# EAGLE schematic VCO-v2 (EAGLE 6.6.0)

## Sheet 1 of 9: Power This part of the circuit handles the input +-12 V supply lines. It creates internal regulated voltage supplies for +5, +9, -5, and -9 V.
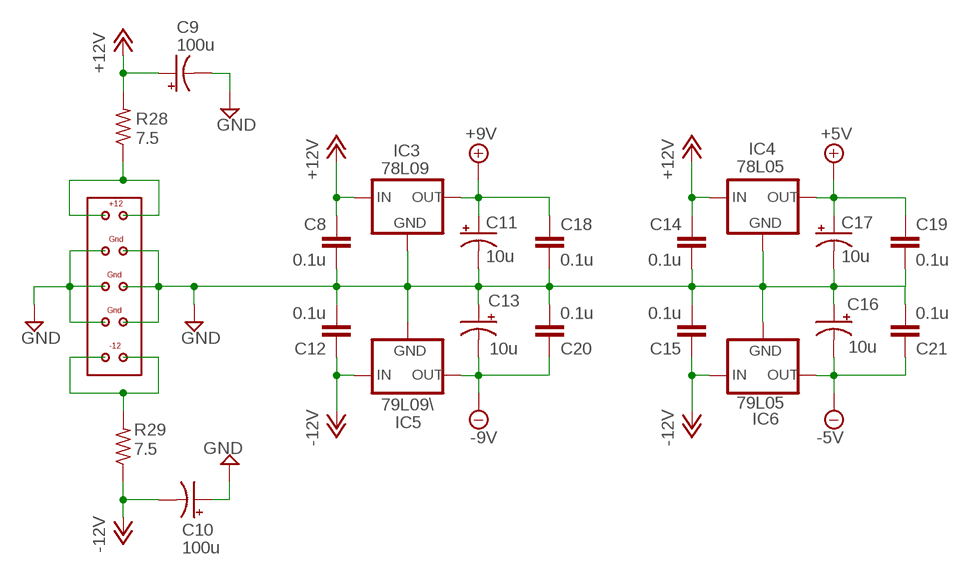
[diagram p0: schematic, sheet 1]

### Parts
C8  0.1u  C-EU025-050X050  [C025-050X050]
C9  100u  CPOL-USE3.5-10  [E3,5-10]
C10  100u  CPOL-USE3.5-10  [E3,5-10]
C11  10u  CPOL-USE3.5-10  [E3,5-10]
C12  0.1u  C-EU025-050X050  [C025-050X050]
C13  10u  CPOL-USE3.5-10  [E3,5-10]
C14  0.1u  C-EU025-050X050  [C025-050X050]
C15  0.1u  C-EU025-050X050  [C025-050X050]
C16  10u  CPOL-USE3.5-10  [E3,5-10]
C17  10u  CPOL-USE3.5-10  [E3,5-10]
C18  0.1u  C-EU025-050X050  [C025-050X050]
C19  0.1u  C-EU025-050X050  [C025-050X050]
C20  0.1u  C-EU025-050X050  [C025-050X050]
C21  0.1u  C-EU025-050X050  [C025-050X050]
IC3  78L09  78LXX  [78LXX]
IC4  78L05  78LXX  [78LXX]
IC5  79L09\  79LXX  [79LXX]
IC6  79L05  79LXX  [79LXX]
R28  7.5  R-US_0204/7  [0204/7]
R29  7.5  R-US_0204/7  [0204/7]
U$3  EURORACK-POWER  [EURORACK-POWER]

### Nets
+5V: C17.+ C19.1 IC4.OUT ; also sheet 2,3,7
+9V: C11.+ C18.1 IC3.OUT ; also sheet 4,8
+12V: C8.1 C9.+ C14.1 IC3.IN IC4.IN R28.2 ; also sheet 2,3,9
-5V: C16.- C21.1 IC6.OUT ; also sheet 2,3,4,5,7
-9V: C13.- C20.1 IC5.OUT ; also sheet 2,4,8
-12V: C10.- C12.1 C15.1 IC5.IN IC6.IN R29.1 ; also sheet 2,3,9
GND: C8.2 C9.- C10.+ C11.- C12.2 C13.+ C14.2 C15.2 C16.+ C17.- C18.2 C19.2 C20.2 C21.2 IC3.GND IC4.GND IC5.GND IC6.GND U$3.P$3 U$3.P$4 U$3.P$5 U$3.P$6 U$3.P$7 U$3.P$8 ; also sheet 2,3,5,6,7,8,9
N$34: R28.1 U$3.P$1 U$3.P$2
N$35: R29.2 U$3.P$9 U$3.P$10

## Sheet 2 of 9: Frequency CV This part of the circuit processes the control voltages for the frequency of the oscillator
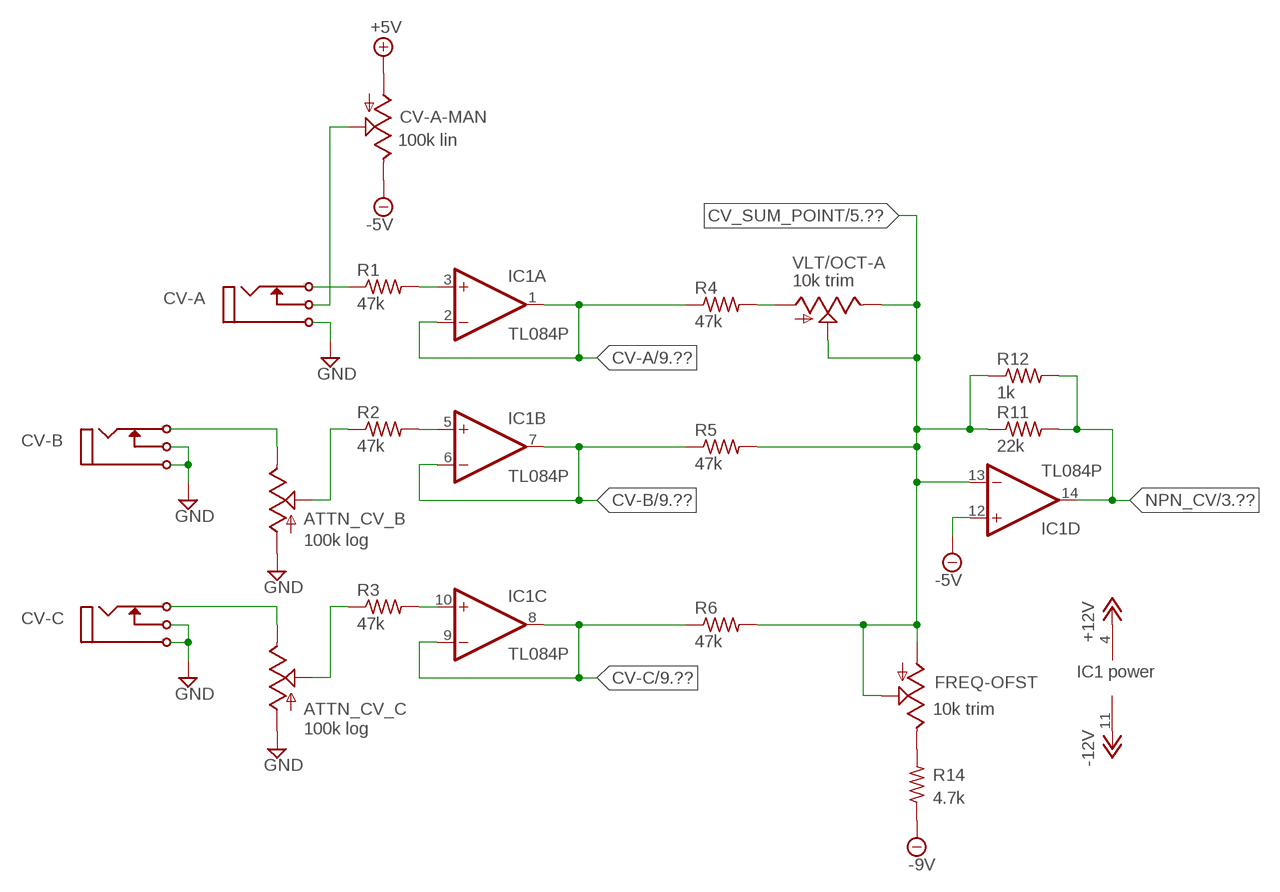
[diagram p1: schematic, sheet 2]

### Parts
ATTN_CV_B  100k log  TRIM_US-B64Y  [B64Y]
ATTN_CV_C  100k log  TRIM_US-B64Y  [B64Y]
CV-A  I/O  MONO_JACK  [MONO_JACK]
CV-A-MAN  100k lin  TRIM_US-B64Y  [B64Y]
CV-B  I/O  MONO_JACK  [MONO_JACK]
CV-C  I/O  MONO_JACK  [MONO_JACK]
FREQ-OFST  10k trim  TRIM_US-B64Y  [B64Y]
IC1  TL084P  [DIL14]
R1  47k  R-US_0204/7  [0204/7]
R2  47k  R-US_0204/7  [0204/7]
R3  47k  R-US_0204/7  [0204/7]
R4  47k  R-US_0204/7  [0204/7]
R5  47k  R-US_0204/7  [0204/7]
R6  47k  R-US_0204/7  [0204/7]
R11  22k  R-US_0204/7  [0204/7]
R12  1k  R-US_0204/7  [0204/7]
R14  4.7k  R-US_0204/7  [0204/7]
VLT/OCT-A  10k trim  TRIM_US-B64Y  [B64Y]

### Nets
+5V: CV-A-MAN.A ; also sheet 1,3,7
+12V: IC1.4(P:V+) ; also sheet 1,3,9
-5V: CV-A-MAN.E IC1.12(D:+IN) ; also sheet 1,3,4,5,7
-9V: R14.1 ; also sheet 1,4,8
-12V: IC1.11(P:V-) ; also sheet 1,3,9
CV-A: IC1.1(A:OUT) IC1.2(A:-IN) R4.1 ; also sheet 9
CV-B: IC1.6(B:-IN) IC1.7(B:OUT) R5.1 ; also sheet 9
CV-C: IC1.8(C:OUT) IC1.9(C:-IN) R6.1 ; also sheet 9
CV_SUM_POINT: FREQ-OFST.A IC1.13(D:-IN) R5.2 R6.2 R11.1 R12.1 VLT/OCT-A.E VLT/OCT-A.S ; also sheet 5
GND: ATTN_CV_B.A ATTN_CV_C.A CV-A.P$1 CV-B.P$1 CV-B.P$3(P3) CV-C.P$1 CV-C.P$3(P3) ; also sheet 1,3,5,6,7,8,9
N$1: CV-A-MAN.S CV-A.P$3(P3)
N$2: CV-A.P$2(P2) R1.1
N$3: IC1.3(A:+IN) IC1.5(B:+IN) IC1.10(C:+IN) R1.2 R2.2 R3.2
N$4: ATTN_CV_C.S R3.1
N$6: ATTN_CV_B.S R2.1
N$8: ATTN_CV_B.E CV-B.P$2(P2)
N$9: ATTN_CV_C.E CV-C.P$2(P2)
N$10: FREQ-OFST.S
N$13: R4.2 VLT/OCT-A.A
N$17: FREQ-OFST.E R14.2
NPN_CV: IC1.14(D:OUT) R11.2 R12.2 ; also sheet 3

### Notes on the sheet
- IC1 power

## Sheet 3 of 9: Voltage->Current This part of the circuit converts the linear voltage CV into a dual exponential current sink and source.
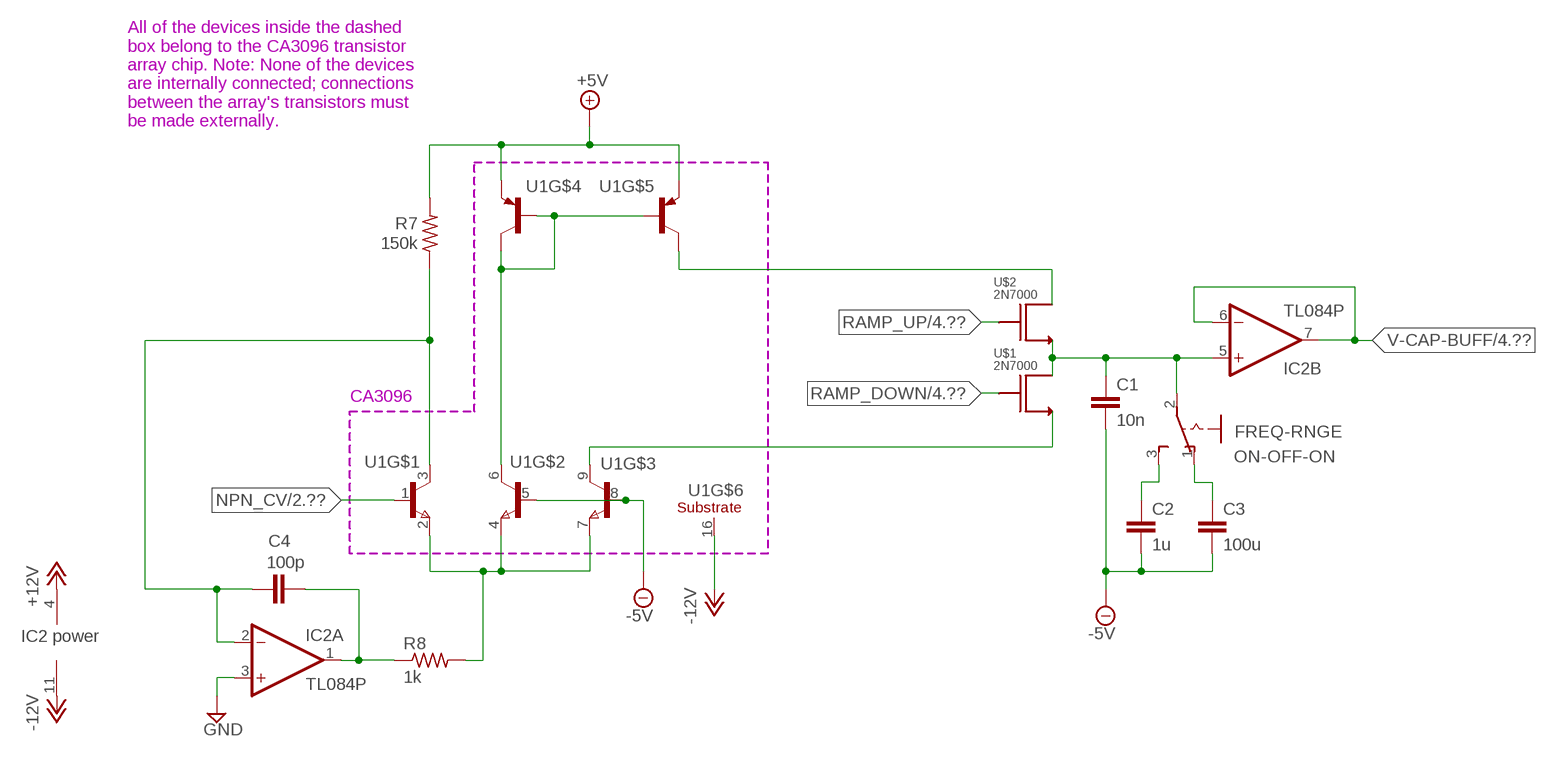
[diagram p2: schematic, sheet 3]

### Parts
C1  10n  C-EU025-025X050  [C025-025X050]
C2  1u  C-EU025-050X050  [C025-050X050]
C3  100u  C-EU050-075X075  [C050-075X075]
C4  100p  C-EU025-025X050  [C025-025X050]
FREQ-RNGE  255SB  [255SB]
IC2  TL084P  [DIL14]
R7  150k  R-US_0204/7  [0204/7]
R8  1k  R-US_0204/7  [0204/7]
U1  CA3096  [DIL16]
U$1  2N7000  [2N7000]
U$2  2N7000  [2N7000]

### Nets
+5V: R7.2 U1.10(E) U1.13(E) ; also sheet 1,2,7
+12V: IC2.4(P:V+) ; also sheet 1,2,9
-5V: C1.2 C2.2 C3.2 U1.5(B) U1.8(B) ; also sheet 1,2,4,5,7
-12V: IC2.11(P:V-) U1.16(E) ; also sheet 1,2,9
GND: IC2.3(A:+IN) ; also sheet 1,2,5,6,7,8,9
N$12: U1.6(C) U1.11(B) U1.12(C) U1.14(B)
N$14: C4.2 IC2.1(A:OUT) R8.1
N$15: R8.2 U1.2(E) U1.4(E) U1.7(E)
N$18: C2.1 FREQ-RNGE.3(S)
N$19: U1.9(C) U$1.S
N$20: U1.15(C) U$2.D
N$21: C4.1 IC2.2(A:-IN) R7.1 U1.3(C)
N$22: C3.1 FREQ-RNGE.1(O)
NPN_CV: U1.1(B) ; also sheet 2
RAMP_DOWN: U$1.G ; also sheet 4,5
RAMP_UP: U$2.G ; also sheet 4,5
TRIANGLE-RAW: C1.1 FREQ-RNGE.2(P) IC2.5(B:+IN) U$1.D U$2.S
V-CAP-BUFF: IC2.6(B:-IN) IC2.7(B:OUT) ; also sheet 4,6

### Notes on the sheet
- All of the devices inside the dashed
  box belong to the CA3096 transistor
  array chip. Note: None of the devices
  are internally connected; connections
  between the array's transistors must
  be made externally.
- CA3096
- ON-OFF-ON
- IC2 power

## Sheet 4 of 9: Hysteresis & Switching This part of the circuit detects when the voltage across the capacitors is too high/low and the caps need to be connected to the opposite polarity current sink/source.
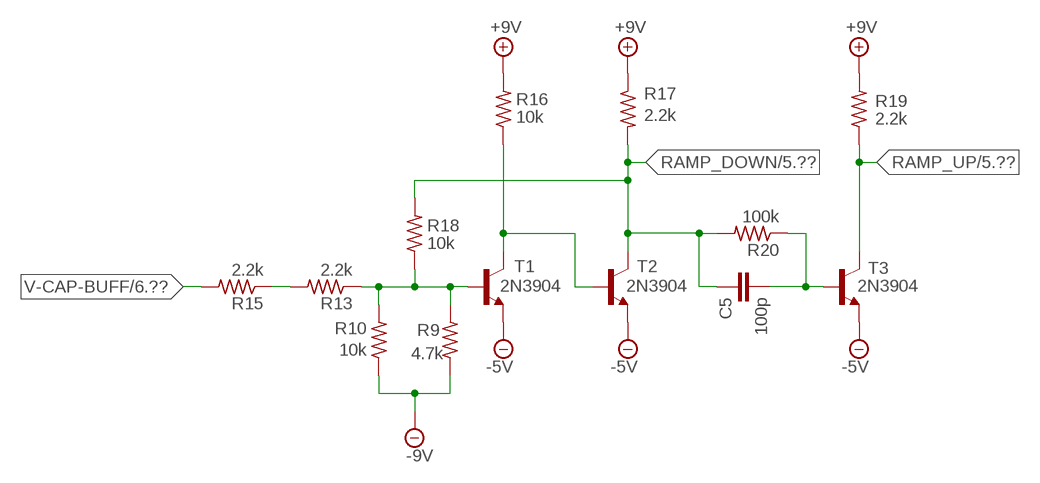
[diagram p3: schematic, sheet 4]

### Parts
C5  100p  C-EU025-050X050  [C025-050X050]
R9  4.7k  R-US_0204/7  [0204/7]
R10  10k  R-US_0204/7  [0204/7]
R13  2.2k  R-US_0204/7  [0204/7]
R15  2.2k  R-US_0204/7  [0204/7]
R16  10k  R-US_0204/7  [0204/7]
R17  2.2k  R-US_0204/7  [0204/7]
R18  10k  R-US_0204/7  [0204/7]
R19  2.2k  R-US_0204/7  [0204/7]
R20  100k  R-US_0204/7  [0204/7]
T1  2N3904  [TO92]
T2  2N3904  [TO92]
T3  2N3904  [TO92]

### Nets
+9V: R16.2 R17.1 R19.2 ; also sheet 1,8
-5V: T1.3(E) T2.3(E) T3.3(E) ; also sheet 1,2,3,5,7
-9V: R9.1 R10.1 ; also sheet 1,2,8
N$16: R16.1 T1.1(C) T2.2(B)
N$23: R9.2 R10.2 R13.1 R18.1 T1.2(B)
N$24: R13.2 R15.1
N$30: C5.2 R20.1 T3.2(B)
RAMP_DOWN: C5.1 R17.2 R18.2 R20.2 T2.1(C) ; also sheet 3,5
RAMP_UP: R19.1 T3.1(C) ; also sheet 3,5
V-CAP-BUFF: R15.2 ; also sheet 3,6

## Sheet 5 of 9: High Frequency Compensation This part of the circuit is responsible for compensating for the oscillator's switching time when transitioning between positive and negative slopes. transients are injected back into the CV_SUM_POINT to raise the effective CV slightly at high frequencies
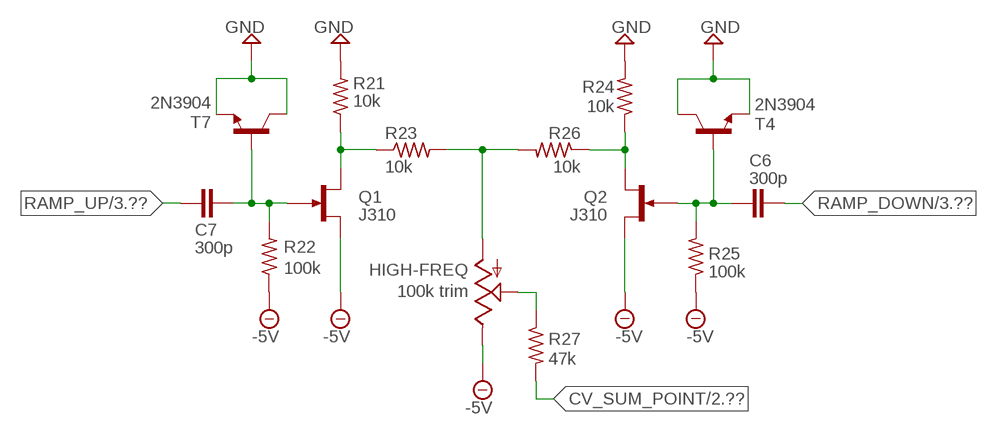
[diagram p4: schematic, sheet 5]

### Parts
C6  300p  C-EU025-050X050  [C025-050X050]
C7  300p  C-EU025-050X050  [C025-050X050]
HIGH-FREQ  100k trim  TRIM_US-B64Y  [B64Y]
Q1  J310  [TO92R]
Q2  J310  [TO92R]
R21  10k  R-US_0204/7  [0204/7]
R22  100k  R-US_0204/7  [0204/7]
R23  10k  R-US_0204/7  [0204/7]
R24  10k  R-US_0204/7  [0204/7]
R25  100k  R-US_0204/7  [0204/7]
R26  10k  R-US_0204/7  [0204/7]
R27  47k  R-US_0204/7  [0204/7]
T4  2N3904  [TO92]
T7  2N3904  [TO92]

### Nets
-5V: HIGH-FREQ.E Q1.S Q2.S R22.1 R25.1 ; also sheet 1,2,3,4,7
CV_SUM_POINT: R27.2 ; also sheet 2
GND: R21.2 R24.2 T4.1(C) T4.3(E) T7.1(C) T7.3(E) ; also sheet 1,2,3,6,7,8,9
N$25: Q1.D R21.1 R23.1
N$26: C7.2 Q1.G R22.2 T7.2(B)
N$29: Q2.D R24.1 R26.1
N$31: C6.2 Q2.G R25.2 T4.2(B)
N$32: HIGH-FREQ.A R23.2 R26.2
N$33: HIGH-FREQ.S R27.1
RAMP_DOWN: C6.1 ; also sheet 3,4
RAMP_UP: C7.1 ; also sheet 3,4

## Sheet 6 of 9: Triangle Output This part of the circuit simply amplifies the triangle signal (from the voltage on the integration cap(s)). The resulting amplified signal is connected to an output jack.
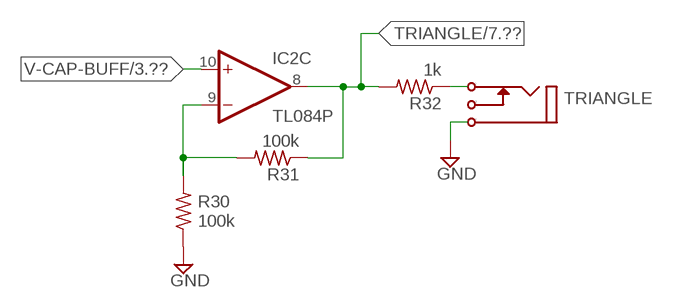
[diagram p5: schematic, sheet 6]

### Parts
R30  100k  R-US_0204/7  [0204/7]
R31  100k  R-US_0204/7  [0204/7]
R32  1k  R-US_0204/7  [0204/7]
TRIANGLE  I/O  MONO_JACK  [MONO_JACK]

### Nets
GND: R30.1 TRIANGLE.P$1 ; also sheet 1,2,3,5,7,8,9
N$27: IC2.9(C:-IN) R30.2 R31.2
N$28: R32.1 TRIANGLE.P$2(P2)
TRIANGLE: IC2.8(C:OUT) R31.1 R32.2 ; also sheet 7,8,9
V-CAP-BUFF: IC2.10(C:+IN) ; also sheet 3,4
Unconnected: TRIANGLE.P$3(P3)

## Sheet 7 of 9: PWM This part of the circuit processes the PWM inputs, the triangle waveform, and generates PWM outputs.
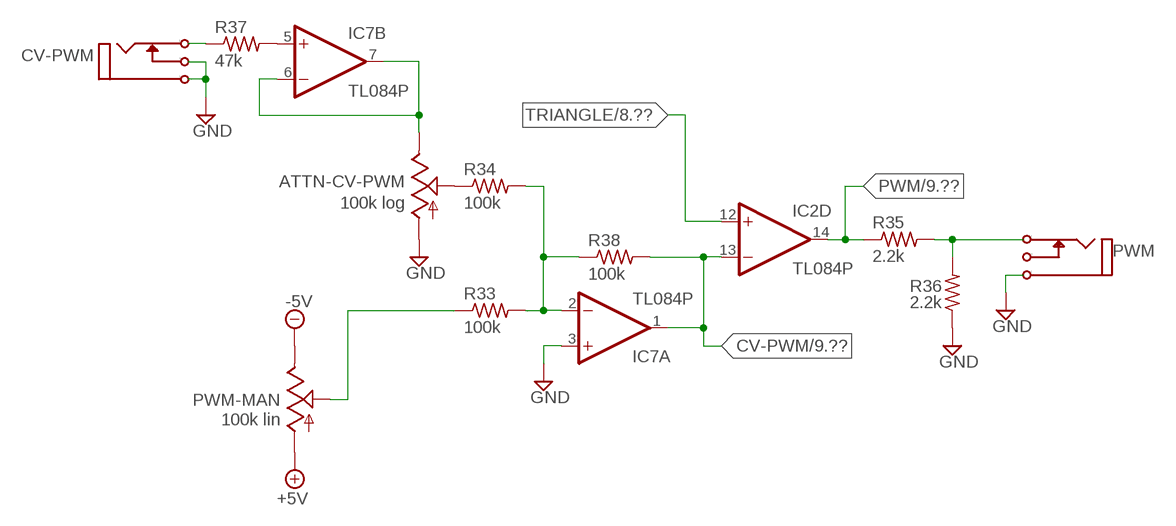
[diagram p6: schematic, sheet 7]

### Parts
ATTN-CV-PWM  100k log  TRIM_US-B64Y  [B64Y]
CV-PWM  I/O  MONO_JACK  [MONO_JACK]
IC7  TL084P  [DIL14]
PWM  I/O  MONO_JACK  [MONO_JACK]
PWM-MAN  100k lin  TRIM_US-B64Y  [B64Y]
R33  100k  R-US_0204/7  [0204/7]
R34  100k  R-US_0204/7  [0204/7]
R35  2.2k  R-US_0204/7  [0204/7]
R36  2.2k  R-US_0204/7  [0204/7]
R37  47k  R-US_0204/7  [0204/7]
R38  100k  R-US_0204/7  [0204/7]

### Nets
+5V: PWM-MAN.A ; also sheet 1,2,3
-5V: PWM-MAN.E ; also sheet 1,2,3,4,5
CV-PWM: IC2.13(D:-IN) IC7.1(A:OUT) R38.2 ; also sheet 9
GND: ATTN-CV-PWM.A CV-PWM.P$1 CV-PWM.P$3(P3) IC7.3(A:+IN) PWM.P$1 R36.1 ; also sheet 1,2,3,5,6,8,9
N$38: PWM.P$2(P2) R35.2 R36.2
N$39: IC7.5(B:+IN) R37.2
N$40: ATTN-CV-PWM.E IC7.6(B:-IN) IC7.7(B:OUT)
N$41: CV-PWM.P$2(P2) R37.1
N$42: ATTN-CV-PWM.S R34.1
N$43: IC7.2(A:-IN) R33.2 R34.2 R38.1
N$45: PWM-MAN.S R33.1
PWM: IC2.14(D:OUT) R35.1 ; also sheet 9
TRIANGLE: IC2.12(D:+IN) ; also sheet 6,8,9
Unconnected: PWM.P$3(P3)

## Sheet 8 of 9: Sine Output This part of the circuit processes the triangle wave nonlinearly to shape it into a fairly sineusoidal waveform.
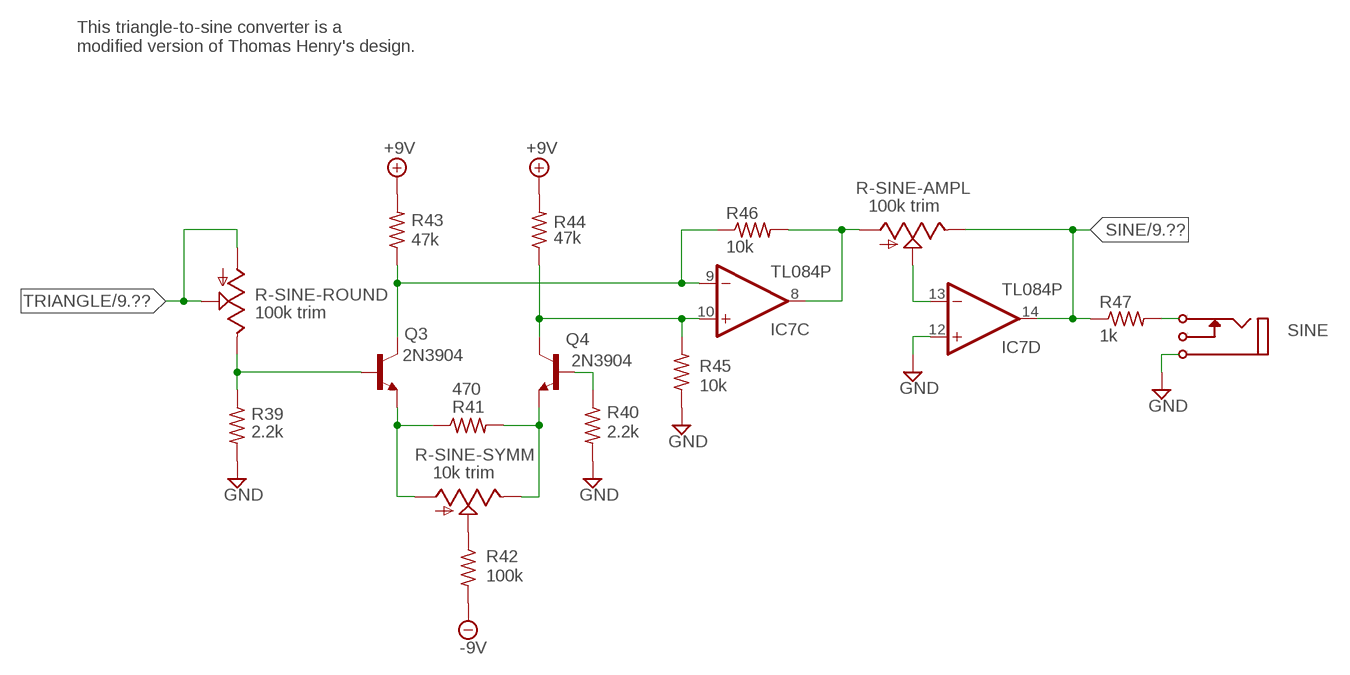
[diagram p7: schematic, sheet 8]

### Parts
Q3  2N3904  [TO92]
Q4  2N3904  [TO92]
R39  2.2k  R-US_0204/7  [0204/7]
R40  2.2k  R-US_0204/7  [0204/7]
R41  470  R-US_0204/7  [0204/7]
R42  100k  R-US_0204/7  [0204/7]
R43  47k  R-US_0204/7  [0204/7]
R44  47k  R-US_0204/7  [0204/7]
R45  10k  R-US_0204/7  [0204/7]
R46  10k  R-US_0204/7  [0204/7]
R47  1k  R-US_0204/7  [0204/7]
R-SINE-AMPL  100k trim  TRIM_US-B64Y  [B64Y]
R-SINE-ROUND  100k trim  TRIM_US-B64Y  [B64Y]
R-SINE-SYMM  10k trim  TRIM_US-B64Y  [B64Y]
SINE  I/O  MONO_JACK  [MONO_JACK]

### Nets
+9V: R43.2 R44.2 ; also sheet 1,4
-9V: R42.2 ; also sheet 1,2,4
GND: IC7.12(D:+IN) R39.2 R40.2 R45.1 SINE.P$1 ; also sheet 1,2,3,5,6,7,9
N$37: Q3.2(B) R39.1 R-SINE-ROUND.E
N$46: Q4.2(B) R40.1
N$47: Q3.3(E) R41.1 R-SINE-SYMM.A
N$48: Q4.3(E) R41.2 R-SINE-SYMM.E
N$49: R42.1 R-SINE-SYMM.S
N$50: IC7.9(C:-IN) Q3.1(C) R43.1 R46.1
N$51: IC7.8(C:OUT) R46.2 R-SINE-AMPL.A
N$52: IC7.10(C:+IN) Q4.1(C) R44.1 R45.2
N$54: IC7.13(D:-IN) R-SINE-AMPL.S
N$55: R47.2 SINE.P$2(P2)
SINE: IC7.14(D:OUT) R47.1 R-SINE-AMPL.E ; also sheet 9
TRIANGLE: R-SINE-ROUND.A R-SINE-ROUND.S ; also sheet 6,7,9
Unconnected: SINE.P$3(P3)

### Notes on the sheet
- This triangle-to-sine converter is a
  modified version of Thomas Henry's design.

## Sheet 9 of 9: LEDs This is just a bunch of LEDs that indicate the voltage levels of the control voltages and the output waveforms.
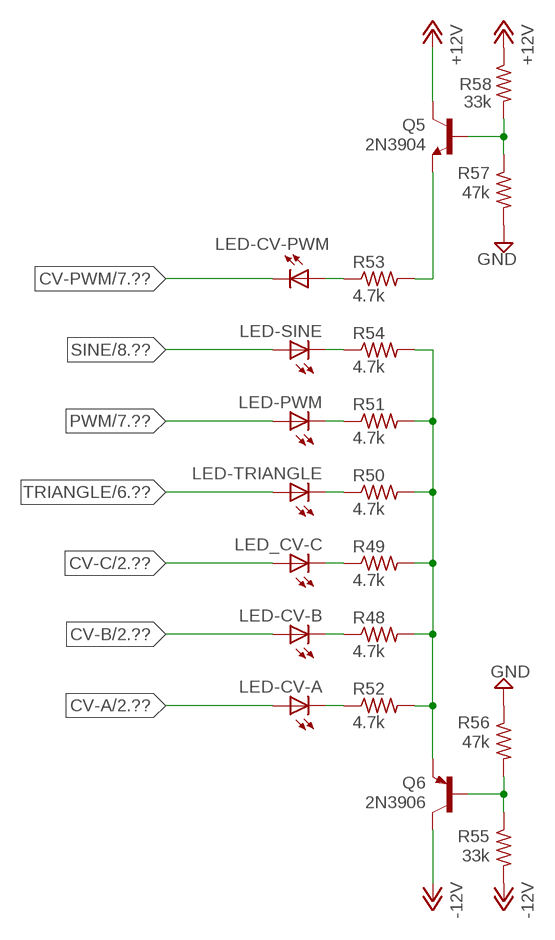
[diagram p8: schematic, sheet 9]

### Parts
LED-CV-A  LED3MM  [LED3MM]
LED-CV-B  LED3MM  [LED3MM]
LED-CV-PWM  LED3MM  [LED3MM]
LED-PWM  LED3MM  [LED3MM]
LED-SINE  LED3MM  [LED3MM]
LED-TRIANGLE  LED3MM  [LED3MM]
LED_CV-C  LED3MM  [LED3MM]
Q5  2N3904  [TO92]
Q6  2N3906  [TO92]
R48  4.7k  R-US_0204/7  [0204/7]
R49  4.7k  R-US_0204/7  [0204/7]
R50  4.7k  R-US_0204/7  [0204/7]
R51  4.7k  R-US_0204/7  [0204/7]
R52  4.7k  R-US_0204/7  [0204/7]
R53  4.7k  R-US_0204/7  [0204/7]
R54  4.7k  R-US_0204/7  [0204/7]
R55  33k  R-US_0204/7  [0204/7]
R56  47k  R-US_0204/7  [0204/7]
R57  47k  R-US_0204/7  [0204/7]
R58  33k  R-US_0204/7  [0204/7]

### Nets
+12V: Q5.1(C) R58.1 ; also sheet 1,2,3
-12V: Q6.1(C) R55.2 ; also sheet 1,2,3
CV-A: LED-CV-A.A ; also sheet 2
CV-B: LED-CV-B.A ; also sheet 2
CV-C: LED_CV-C.A ; also sheet 2
CV-PWM: LED-CV-PWM.K(C) ; also sheet 7
GND: R56.1 R57.2 ; also sheet 1,2,3,5,6,7,8
N$5: Q6.2(B) R55.1 R56.2
N$7: LED-CV-PWM.A R53.1
N$11: Q5.3(E) R53.2
N$36: Q6.3(E) R48.2 R49.2 R50.2 R51.2 R52.2 R54.2
N$44: Q5.2(B) R57.1 R58.2
N$53: LED-CV-A.K(C) R52.1
N$56: LED-CV-B.K(C) R48.1
N$61: LED_CV-C.K(C) R49.1
N$62: LED-TRIANGLE.K(C) R50.1
N$63: LED-PWM.K(C) R51.1
N$64: LED-SINE.K(C) R54.1
PWM: LED-PWM.A ; also sheet 7
SINE: LED-SINE.A ; also sheet 8
TRIANGLE: LED-TRIANGLE.A ; also sheet 6,7,8

## Power pins joined to a net without a drawn wire
V+: IC7.4(P:V+)
V-: IC7.11(P:V-)

## Library data of the parts
ATTN-CV-PWM ATTN_CV_B ATTN_CV_C CV-A-MAN FREQ-OFST HIGH-FREQ PWM-MAN R-SINE-AMPL R-SINE-ROUND R-SINE-SYMM VLT/OCT-A = pot:TRIM_US-: POTENTIOMETER
C1-C8 C12 C14 C15 C18-C21 = resistor:C-EU: CAPACITOR, European symbol
C9-C11 C13 C16 C17 = rcl:CPOL-US: POLARIZED CAPACITOR, American symbol
CV-A CV-B CV-C CV-PWM PWM SINE TRIANGLE = !synth_sch:MONO_JACK
FREQ-RNGE = switch:255SB: SLIDING SWITCH Distributor Buerklin, 11G810
IC1 IC2 IC7 = linear:TL084: OP AMP
IC3 IC4 = v-reg:78LXX: VOLTAGE REGULATOR
IC5 IC6 = v-reg:79LXX: VOLTAGE REGULATOR
LED-CV-A LED-CV-B LED-CV-PWM LED-PWM LED-SINE LED-TRIANGLE LED_CV-C = led:LED: LED OSRAM: - CHIPLED LG R971, LG N971, LY N971, LG Q971, LY Q971, LO R971, LY R971 LH N974, LH R974 LS Q976, LO Q976, LY Q976 LO Q996 - Hyper CHIPLED LW Q18S LB Q993, LB Q99A, LB R99A - SideLED LS A670, LO A670, LY A670, LG A670, LP A670 LB A673, LV A673, LT A673, LW A673 LH A674 LY A675 LS A676, LA A676, LO A676, LY A676, LW A676 LS A679, LY A679, LG A679 - Hyper Micro SIDELED® LS Y876, LA Y876, LO Y876, LY Y876 LT Y87S - SmartLED LW L88C, LW L88S LB L89C, LB L89S, LG L890 LS L89K, LO L89K, LY L89K LS L896, LA L896, LO L896, LY L896 - TOPLED LS T670, LO T670, LY T670, LG T670, LP T670 LSG T670, LSP T670, LSY T670, LOP T670, LYG T670 LG T671, LOG T671, LSG T671 LB T673, LV T673, LT T673, LW T673 LH T674 LS T676, LA T676, LO T676, LY T676, LB T676, LH T676, LSB T676, LW T676 LB T67C, LV T67C, LT T67C, LS T67K, LO T67K, LY T67K, LW E67C LS E67B, LA E67B, LO E67B, LY E67B, LB E67C, LV E67C, LT E67C LW T67C LS T679, LY T679, LG T679 LS T770, LO T770, LY T770, LG T770, LP T770 LB T773, LV T773, LT T773, LW T773 LH T774 LS E675, LA E675, LY E675, LS T675 LS T776, LA T776, LO T776, LY T776, LB T776 LHGB T686 LT T68C, LB T68C - Hyper Mini TOPLED® LB M676 - Mini TOPLED Santana® LG M470 LS M47K, LO M47K, LY M47K Source: http://www.osram.convergy.de LUXEON: - LUMILED® LXK2-PW12-R00, LXK2-PW12-S00, LXK2-PW14-U00, LXK2-PW14-V00 LXK2-PM12-R00, LXK2-PM12-S00, LXK2-PM14-U00 LXK2-PE12-Q00, LXK2-PE12-R00, LXK2-PE12-S00, LXK2-PE14-T00, LXK2-PE14-U00 LXK2-PB12-K00, LXK2-PB12-L00, LXK2-PB12-M00, LXK2-PB14-N00, LXK2-PB14-P00, LXK2-PB14-Q00 LXK2-PR12-L00, LXK2-PR12-M00, LXK2-PR14-Q00, LXK2-PR14-R00 LXK2-PD12-Q00, LXK2-PD12-R00, LXK2-PD12-S00 LXK2-PH12-R00, LXK2-PH12-S00 LXK2-PL12-P00, LXK2-PL12-Q00, LXK2-PL12-R00 Source: www.luxeon.com KINGBRIGHT: KA-3528ASYC Source: www.kingbright.com
Q1 Q2 = transistor-small-signal:J310: N-Channel RF Amplifier J309, J310 Source: http://www.fairchildsemi.com/pf/J3/J310.html
Q3-Q5 = transistor-npn:2N3904: NPN Transistor
Q6 = transistor-pnp:2N3906: PNP Transistor
R1-R58 = resistor:R-US_: RESISTOR, American symbol
T1-T4 T7 = transistor-neu-to92:2N3904: NPN TRANSISTOR
U1 = !synthdiy:CA3096
U$1 U$2 = !synth_sch:2N7000
U$3 = !synth_sch:EURORACK-POWER